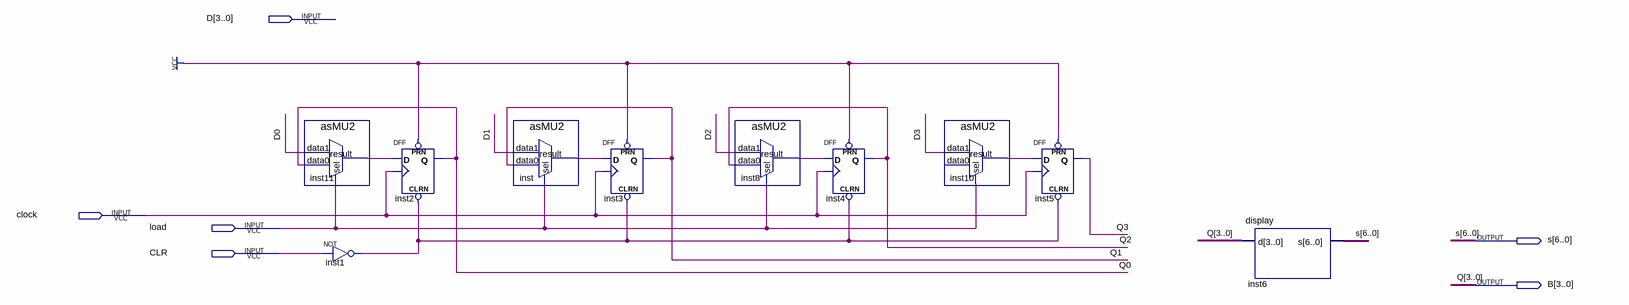
[diagram p0: schematic sheet]
// Quartus schematic registrador.bdf as structural Verilog: 10 symbols, 6 pins
module registrador (
  input  [3:0] D,
  input  clock,
  input  load,
  input  CLR,
  output [6:0] s,
  output [3:0] B
);

  wire inst1_out, inst8_result, inst10_result, inst11_result, inst_result;

  asMU2 inst11 (.data1(D[0]), .data0(B[0]), .sel(load), .result(inst11_result));
  not inst1 (inst1_out, CLR);
  DFF inst2 (.CLRN(inst1_out), .CLK(clock), .D(inst11_result), .PRN(1'b1), .Q(B[0]));
  asMU2 inst (.data1(D[1]), .data0(B[1]), .sel(load), .result(inst_result));
  DFF inst3 (.CLRN(inst1_out), .CLK(clock), .D(inst_result), .PRN(1'b1), .Q(B[1]));
  asMU2 inst8 (.data1(D[2]), .data0(B[2]), .sel(load), .result(inst8_result));
  DFF inst4 (.CLRN(inst1_out), .CLK(clock), .D(inst8_result), .PRN(1'b1), .Q(B[2]));
  asMU2 inst10 (.data1(D[3]), .sel(load), .result(inst10_result));  // open: data0
  DFF inst5 (.CLRN(inst1_out), .CLK(clock), .D(inst10_result), .PRN(1'b1), .Q(B[3]));
  display inst6 (.d(B), .s(s));

  // Other names for the same wires on the sheet: Q[3:0] = B; Q0 = B[0]; Q1 = B[1]; Q2 = B[2]; Q3 = B[3]
endmodule
